# Altium schematic sheet MB1046.SchDoc: 4.3 inch LCD board
size A4; DocumentNumber: 2; Revision: B.1(PCB.SCH); SheetNumber: 2; SheetTotal: 2
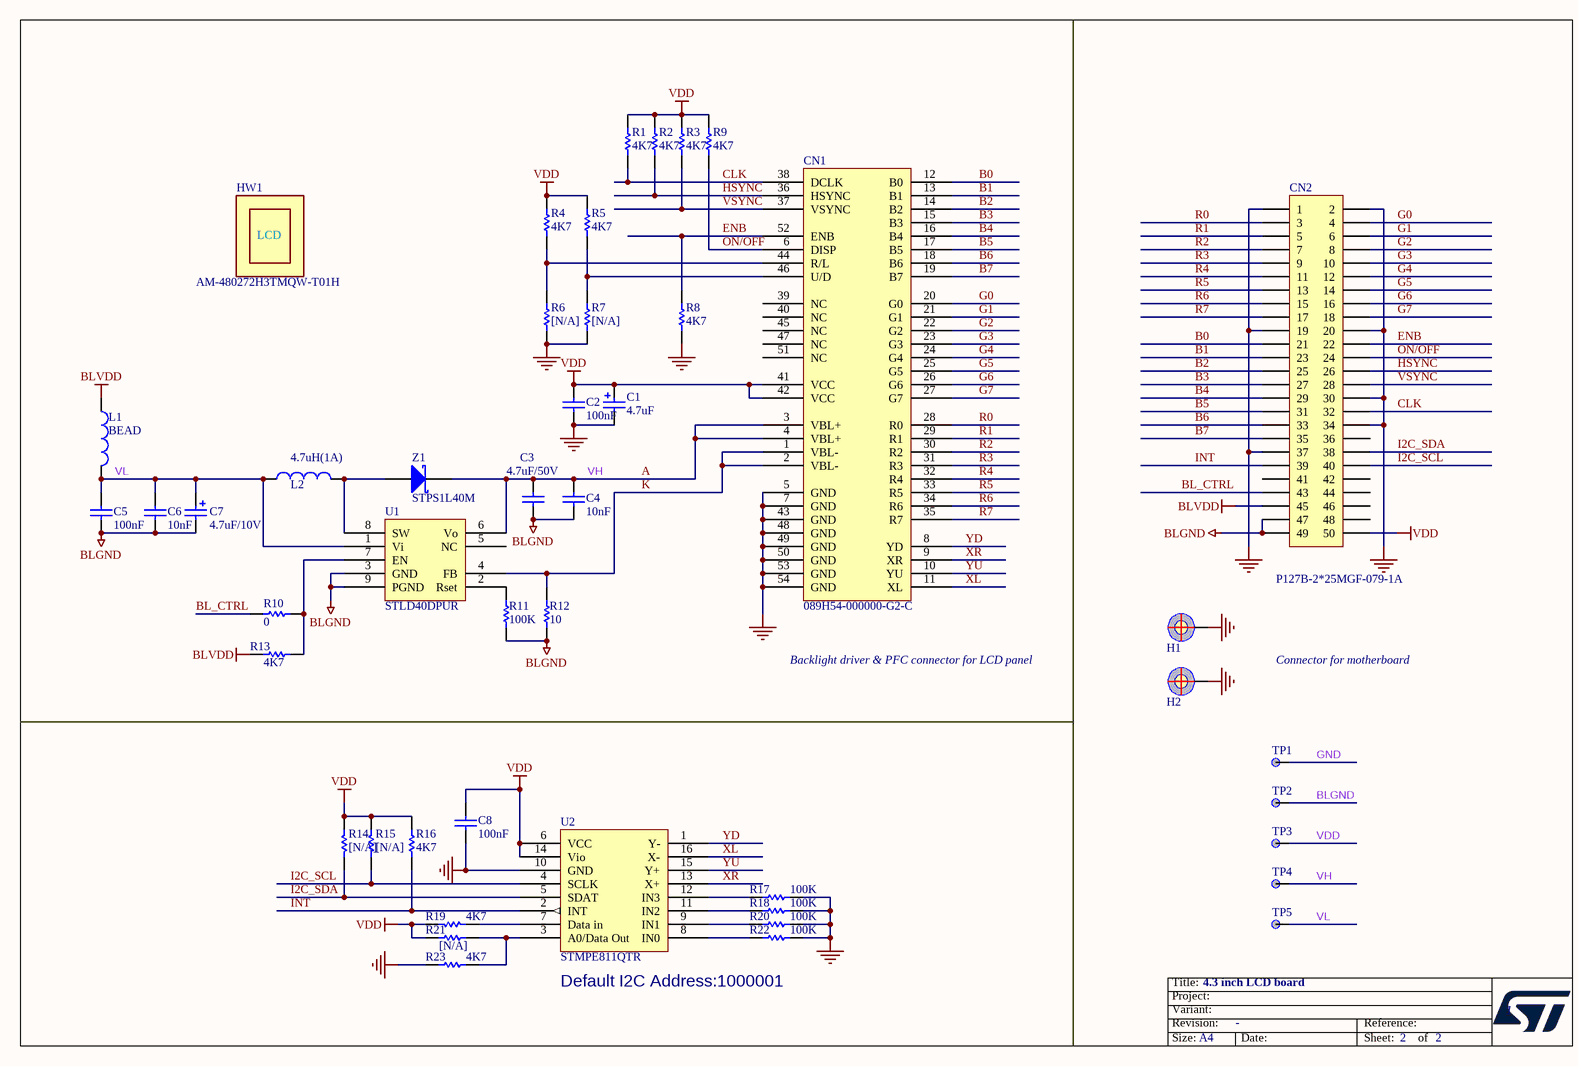
[diagram p0: MB1046.SchDoc]

## Parts
C1  4.7uF  [TAN-A]
C2  100nF  [0603C]
C3  4.7uF/50V  [1206C]
C4  10nF  [0603C]
C5  100nF  [0603C]
C6  10nF  [0603C]
C7  4.7uF/10V  [1206C]
C8  100nF  [0603C]
CN1  089H54-000000-G2-C  [FPC54_0R5_089H54_LY-FPC]
CN2  P127B-2*25MGF-079-1A  [FTSH-125-01-F-DV]
H1  POSITION HOLE  [HOLE_C9D4R5]  (value not drawn)
H2  POSITION HOLE  [HOLE_C9D4R5]  (value not drawn)
HW1  AM-480272H3TMQW-T01H  (mechanical)
L1  BEAD  [0603L]
L2  4.7uH(1A)  [1210L]
R1  4K7  [0603R]
R2  4K7  [0603R]
R3  4K7  [0603R]
R4  4K7  [0603R]
R5  4K7  [0603R]
R6  [N/A]  [0603R]
R7  [N/A]  [0603R]
R8  4K7  [0603R]
R9  4K7  [0603R]
R10  0  [0603R]
R11  100K  [0603R]
R12  10  [0603R]
R13  4K7  [0603R]
R14  [N/A]  [0603R]
R15  [N/A]  [0603R]
R16  4K7  [0603R]
R17  100K  [0603R]
R18  100K  [0603R]
R19  4K7  [0603R]
R20  100K  [0603R]
R21  [N/A]  [0603R]
R22  100K  [0603R]
R23  4K7  [0603R]
TP1  (no value)  [TP]
TP2  (no value)  [TP]
TP3  (no value)  [TP]
TP4  (no value)  [TP]
TP5  (no value)  [TP]
U1  STLD40DPUR  [SON8_0R65_3X3]
U2  STMPE811QTR  [QFN16_0R5_3X3]
Z1  STPS1L40M  [DO-216AA]

## Nets
BLGND: C3.2 C4.1 C5.1 C6.1 C7.2 CN2.47 CN2.49 R11.2 R12.1 TP2.1 U1.3(GND) U1.9(PGND)
BLVDD: CN2.45 L1.1 R13.2
GND: C1.2 C2.1 C8.2 CN1.5(GND) CN1.7(GND) CN1.43(GND) CN1.48(GND) CN1.49(GND) CN1.50(GND) CN1.53(GND) CN1.54(GND) CN2.1 CN2.2 CN2.19 CN2.20 CN2.30 CN2.34 CN2.37 H1.1 H2.1 R6.2 R7.2 R8.2 R17.1 R18.1 R20.1 R22.1 R23.1 TP1.1 U2.10(GND)
VDD: C1.1 C2.2 C8.1 CN1.41(VCC) CN1.42(VCC) CN2.50 R1.1 R2.1 R3.1 R4.1 R5.1 R9.1 R14.2 R15.2 R16.1 R19.2 R21.2 TP3.1 U2.6(VCC) U2.14(Vio)
A: C3.1 C4.2 CN1.3(VBL+) CN1.4(VBL+) TP4.1 U1.6(Vo) Z1.2(K)  [also labelled VH]
B0: CN1.12(B0) CN2.21
B1: CN1.13(B1) CN2.23
B2: CN1.14(B2) CN2.25
B3: CN1.15(B3) CN2.27
B4: CN1.16(B4) CN2.29
B5: CN1.17(B5) CN2.31
B6: CN1.18(B6) CN2.33
B7: CN1.19(B7) CN2.35
BL_CTRL: CN2.43 R10.2
CLK: CN1.38(DCLK) CN2.32 R1.2
ENB: CN1.52(ENB) CN2.22 R8.1
G0: CN1.20(G0) CN2.4
G1: CN1.21(G1) CN2.6
G2: CN1.22(G2) CN2.8
G3: CN1.23(G3) CN2.10
G4: CN1.24(G4) CN2.12
G5: CN1.25(G5) CN2.14
G6: CN1.26(G6) CN2.16
G7: CN1.27(G7) CN2.18
HSYNC: CN1.36(HSYNC) CN2.26 R2.2
I2C_SCL: CN2.40 R15.1 U2.4(SCLK)
I2C_SDA: CN2.38 R14.1 U2.5(SDAT)
INT: CN2.39 R16.2 U2.2(INT)
K: CN1.1(VBL-) CN1.2(VBL-) R12.2 U1.4(FB)
ON/OFF: CN1.6(DISP) CN2.24 R9.2
R0: CN1.28(R0) CN2.3
R1: CN1.29(R1) CN2.5
R2: CN1.30(R2) CN2.7
R3: CN1.31(R3) CN2.9
R4: CN1.32(R4) CN2.11
R5: CN1.33(R5) CN2.13
R6: CN1.34(R6) CN2.15
R7: CN1.35(R7) CN2.17
VL: C5.2 C6.2 C7.1 L1.2 L2.1 TP5.1 U1.1(Vi)
VSYNC: CN1.37(VSYNC) CN2.28 R3.2
XL: CN1.11(XL) U2.16(X-)
XR: CN1.9(XR) U2.13(X+)
YD: CN1.8(YD) U2.1(Y-)
YU: CN1.10(YU) U2.15(Y+)
NetCN1_44: CN1.44(R/L) R4.2 R6.1
NetCN1_46: CN1.46(U/D) R5.2 R7.1
NetL2_2: L2.2 U1.8(SW) Z1.1(A)
NetR10_1: R10.1 R13.1 U1.7(EN)
NetR11_1: R11.1 U1.2(Rset)
NetR17_2: R17.2 U2.12(IN3)
NetR18_2: R18.2 U2.11(IN2)
NetR19_1: R19.1 U2.7(Data_in)
NetR20_2: R20.2 U2.9(IN1)
NetR21_1: R21.1 R23.2 U2.3(A0/Data_Out)
NetR22_2: R22.2 U2.8(IN0)

Not connected (* = marked no-connect by the designer): CN1 39(NC) 40(NC) 45(NC) 47(NC) 51(NC); CN2 36 41 42 44 46 48; U1 5(NC)

## Notes on the sheet
- Backlight driver & PFC connector for LCD panel
- Connector for motherboard
- Default I2C Address:1000001
- 1
- Title:
- Project:
- Size:
- Revision:
- Variant:
- A4
- -
- Date:
- Reference:
- Sheet:
- of
- (in symbol LCD_MODULE) LCD

## Library data of the parts
C1 C7 = Cap Pol1: Polarized Capacitor (Radial); Value: 100pF; Published: 8-Jun-2000; Revision: July-2002: Re-released for DXP Platform.; Publisher: Altium Limited
C2-C6 C8 = CAP: Capacitor; Value: 100pF; Published: 8-Jun-2000; Revision: July-2002: Re-released for DXP Platform.; Publisher: Altium Limited
CN2 = Header 25X2: Header, 26-Pin, Dual row; Revision: 17-Jul-2002: Re-released for DXP Platform.; Publisher: Altium Limited
HW1 = LCD_MODULE
L1 L2 = Inductor: Value: 100uH; Published: 8-Jun-2000; Revision: July-2002: Re-released for DXP Platform.; Publisher: Altium Limited
R1-R16 R19 R21 R23 = Res1: Resistor; Value: 1K; Published: 8-Jun-2000; Revision: July-2002: Re-released for DXP Platform.; Publisher: Altium Limited
R17 R18 R20 R22 = res1: Resistor; Published: 8-Jun-2000; Revision: July-2002: Re-released for DXP Platform.; Publisher: Altium Limited; Value: 100K
TP1-TP5 = TP
U1 = STLD40DPMR
U2 = STMPE811
Z1 = D Schottky: Schottky Diode; Code - JEDEC: DO-214-AA; Published: 8-Jun-2000; Revision: July-2002: Re-released for DXP Platform.; Publisher: Altium Limited